# EAGLE schematic ControlBoard (EAGLE 6.3)
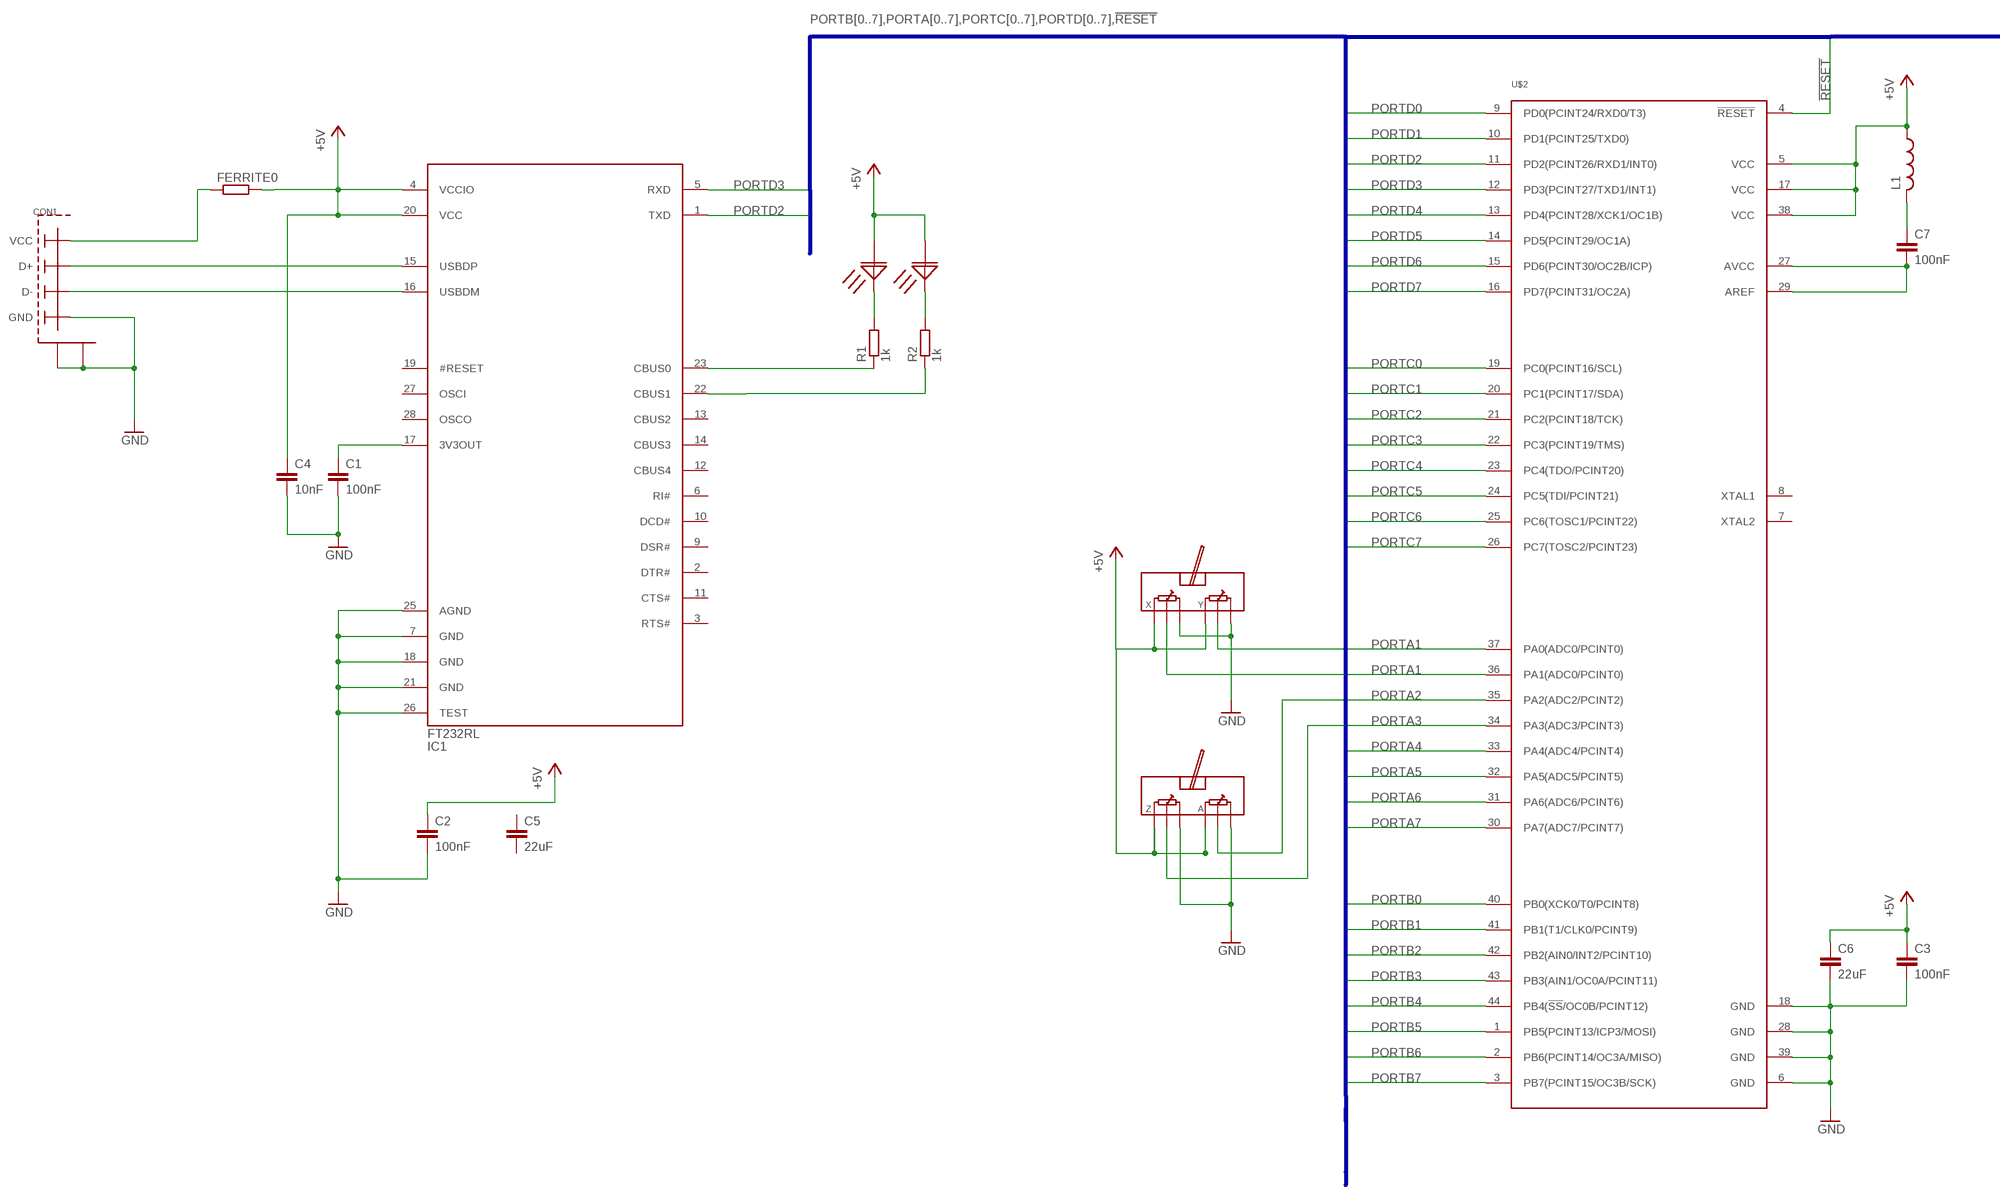
[diagram p0: schematic, sheet 1, part 1 of 2]
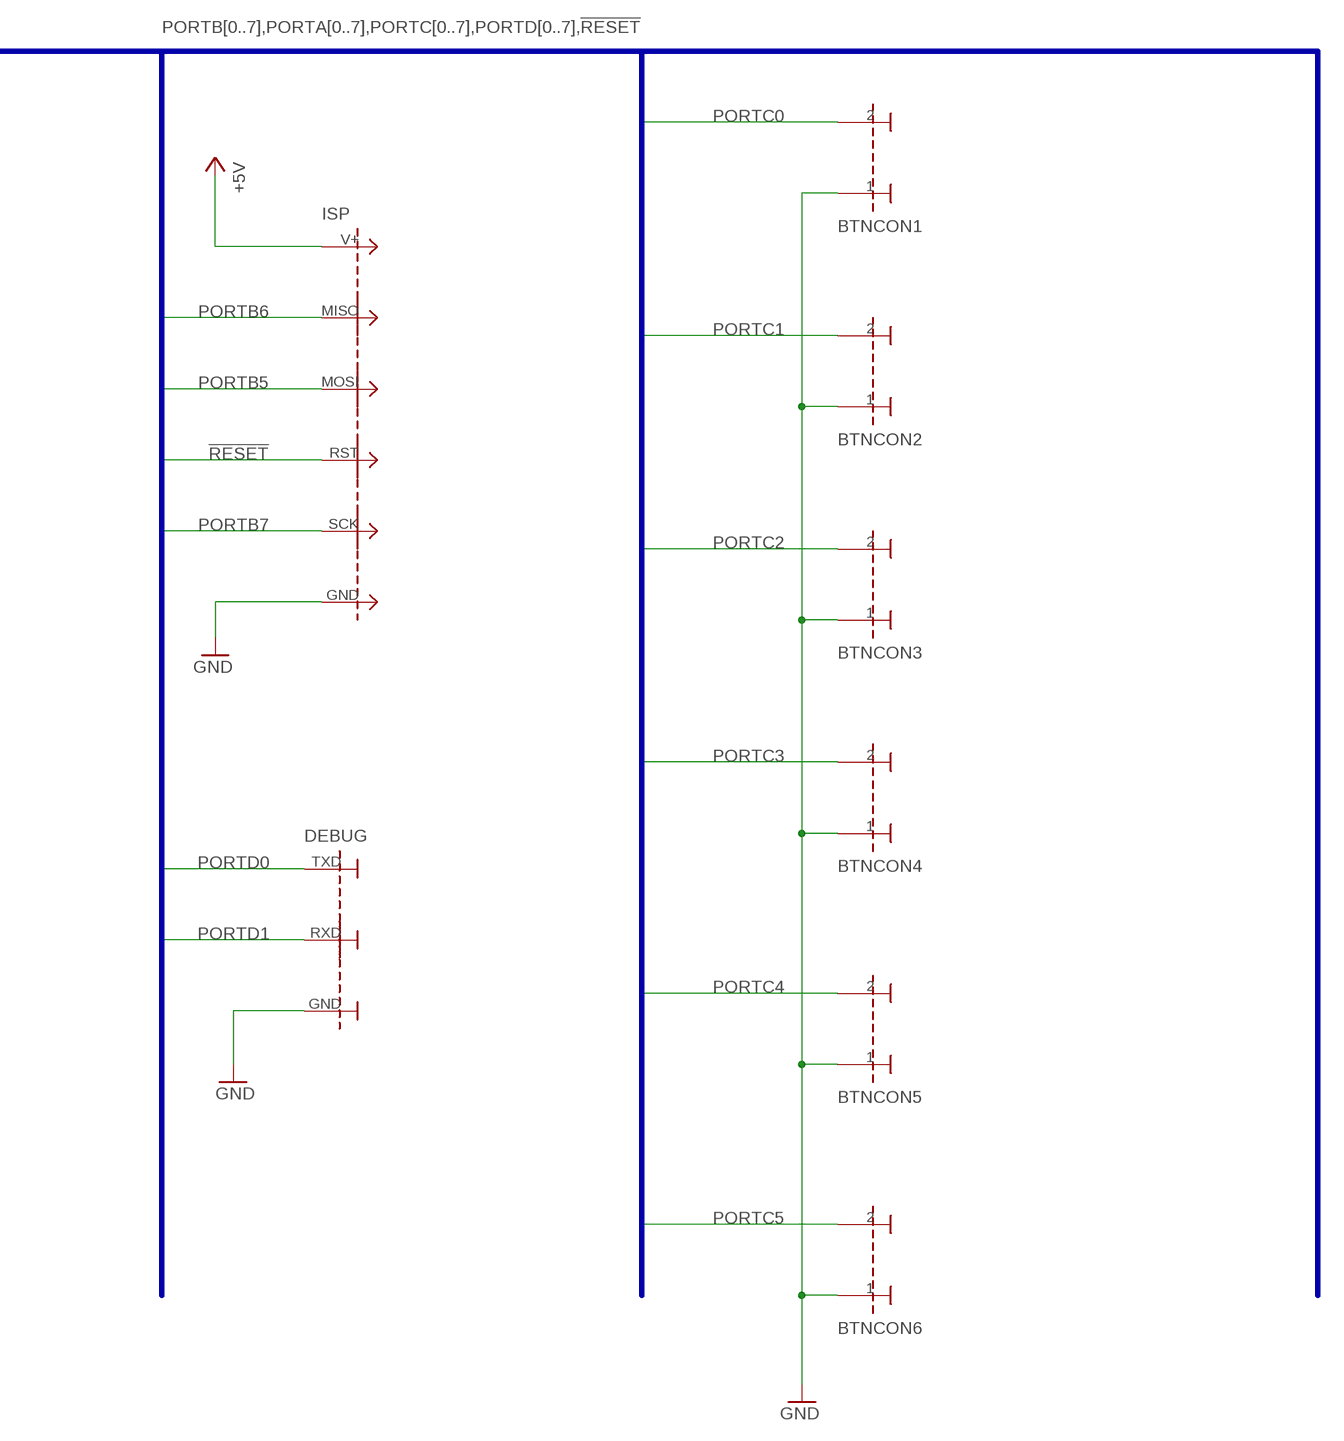
[diagram p1: schematic, sheet 1, part 2 of 2]

## Parts
BTNCON1  CONNECTOR_2PIN1X2_WIRE  [1X2_WIRE]
BTNCON2  CONNECTOR_2PIN1X2_WIRE  [1X2_WIRE]
BTNCON3  CONNECTOR_2PIN1X2_WIRE  [1X2_WIRE]
BTNCON4  CONNECTOR_2PIN1X2_WIRE  [1X2_WIRE]
BTNCON5  CONNECTOR_2PIN1X2_WIRE  [1X2_WIRE]
BTNCON6  CONNECTOR_2PIN1X2_WIRE  [1X2_WIRE]
C1  100nF  C-EUC0805  [C0805@1]
C2  100nF  C-EUC0805  [C0805@1]
C3  100nF  C-EUC0805  [C0805@1]
C4  10nF  C-EUC0805  [C0805@1]
C5  22uF  C-EUC1206  [C1206]
C6  22uF  C-EUC1206  [C1206]
C7  100nF  C-EUC0805  [C0805@1]
CON1  USB-BWUERTH-ELECTRONIC-USB-B  [USB-B-THROUGH-HOLE]
DEBUG  CONNECTOR_3PINUSART  [1X3_USART]
FERRITE0  R-EU_R0805  [R0805]
IC1  FT232RL  [SSOP28]
ISP  CONNECTOR_6PIN2X3_ISP  [2X3_ISP]
JOYSTICK1  JOYSTIC-XYRKJXK122000D  [JOYSTICK-RKJXK122000D]
JOYSTICK2  JOYSTIC-XYRKJXK122000D  [JOYSTICK-RKJXK122000D]
L1  L-USL0805  [C0805]
R1  1k  R-EU_R0805  [R0805]
R2  1k  R-EU_R0805  [R0805]
RX  LED  [LED_0805]
TX  LED  [LED_0805]
U$2  ATMEGA[164/324/644/644][A/PA]TQFP/QFN/MLF  [QFP-44]

## Nets
!RESET: ISP.RST U$2.4(!RESET)
+5V: C2.1 C3.1 C4.1 C6.1 FERRITE0.2 IC1.4(VCCIO) IC1.20(VCC) ISP.V+ JOYSTICK1.X1 JOYSTICK1.Y1 JOYSTICK2.X1 JOYSTICK2.Y1 L1.1 RX.A TX.A U$2.5(VCC) U$2.17(VCC) U$2.38(VCC)
GND: BTNCON1.1 BTNCON2.1 BTNCON3.1 BTNCON4.1 BTNCON5.1 BTNCON6.1 C1.2 C2.2 C3.2 C4.2 C6.2 CON1.GND CON1.SHIELD CON1.SHIELD@2(SHIELD) DEBUG.GND IC1.7(GND) IC1.18(GND) IC1.21(GND) IC1.25(AGND) IC1.26(TEST) ISP.GND JOYSTICK1.X3 JOYSTICK1.Y3 JOYSTICK2.X3 JOYSTICK2.Y3 U$2.6(GND) U$2.18(GND) U$2.28(GND) U$2.39(GND)
N$1: C7.2 U$2.27(AVCC) U$2.29(AREF)
N$2: IC1.23(CBUS0) R1.1
N$3: IC1.22(CBUS1) R2.1
N$4: R1.2 RX.K
N$5: C7.1 L1.2
N$6: CON1.D+ IC1.15(USBDP)
N$7: CON1.D- IC1.16(USBDM)
N$8: CON1.VCC FERRITE0.1
N$9: R2.2 TX.K
N$10: C1.1 IC1.17(3V3OUT)
PORTA0: JOYSTICK1.Y2 U$2.37(PA0(ADC0/PCINT0))
PORTA1: JOYSTICK1.X2 U$2.36(PA1(ADC0/PCINT0))
PORTA2: JOYSTICK2.Y2 U$2.35(PA2(ADC2/PCINT2))
PORTA3: JOYSTICK2.X2 U$2.34(PA3(ADC3/PCINT3))
PORTA4: U$2.33(PA4(ADC4/PCINT4))
PORTA5: U$2.32(PA5(ADC5/PCINT5))
PORTA6: U$2.31(PA6(ADC6/PCINT6))
PORTA7: U$2.30(PA7(ADC7/PCINT7))
PORTB0: U$2.40(PB0(XCK0/T0/PCINT8))
PORTB1: U$2.41(PB1(T1/CLK0/PCINT9))
PORTB2: U$2.42(PB2(AIN0/INT2/PCINT10))
PORTB3: U$2.43(PB3(AIN1/OC0A/PCINT11))
PORTB4: U$2.44(PB4(!SS!/OC0B/PCINT12))
PORTB5: ISP.MOSI U$2.1(PB5(PCINT13/ICP3/MOSI))
PORTB6: ISP.MISO U$2.2(PB6(PCINT14/OC3A/MISO))
PORTB7: ISP.SCK U$2.3(PB7(PCINT15/OC3B/SCK))
PORTC0: BTNCON1.2 U$2.19(PC0(PCINT16/SCL))
PORTC1: BTNCON2.2 U$2.20(PC1(PCINT17/SDA))
PORTC2: BTNCON3.2 U$2.21(PC2(PCINT18/TCK))
PORTC3: BTNCON4.2 U$2.22(PC3(PCINT19/TMS))
PORTC4: BTNCON5.2 U$2.23(PC4(TDO/PCINT20))
PORTC5: BTNCON6.2 U$2.24(PC5(TDI/PCINT21))
PORTC6: U$2.25(PC6(TOSC1/PCINT22))
PORTC7: U$2.26(PC7(TOSC2/PCINT23))
PORTD0: DEBUG.TXD U$2.9(PD0(PCINT24/RXD0/T3))
PORTD1: DEBUG.RXD U$2.10(PD1(PCINT25/TXD0))
PORTD2: IC1.1(TXD) U$2.11(PD2(PCINT26/RXD1/INT0))
PORTD3: IC1.5(RXD) U$2.12(PD3(PCINT27/TXD1/INT1))
PORTD4: U$2.13(PD4(PCINT28/XCK1/OC1B))
PORTD5: U$2.14(PD5(PCINT29/OC1A))
PORTD6: U$2.15(PD6(PCINT30/OC2B/ICP))
PORTD7: U$2.16(PD7(PCINT31/OC2A))
Unconnected: C5.1 C5.2 IC1.2(DTR#) IC1.3(RTS#) IC1.6(RI#) IC1.9(DSR#) IC1.10(DCD#) IC1.11(CTS#) IC1.12(CBUS4) IC1.13(CBUS2) IC1.14(CBUS3) IC1.19(#RESET) IC1.27(OSCI) IC1.28(OSCO) U$2.7(XTAL2) U$2.8(XTAL1)

## Buses
PORTB[0..7],PORTA[0..7],PORTC[0..7],PORTD[0..7],!RESET

## Library data of the parts
BTNCON1-BTNCON6 = connectors:CONNECTOR_2PIN; OC_NEWARK: unknown; PIN1: 1; PIN2: 2
C1-C3 C7 = RC_and_L:C-EU: CAPACITOR, European symbol; MF: FARNELL; MPN: KP-2012SEC; OC_NEWARK: 38K3382
C4 = RC_and_L:C-EU: CAPACITOR, European symbol; MPN: 04023D103KAT2A; OC_NEWARK: 50R8273
C5 C6 = RC_and_L:C-EU: CAPACITOR, European symbol; OC_NEWARK: unknown
CON1 = jogwheelParts:USB-B: USB, type B connector.; DATASHEET: http://www.farnell.com/datasheets/1442182.pdf; FARNELL: http://fi.farnell.com/jsp/search/productdetail.jsp?SKU=1642035; OC_NEWARK: unknown
DEBUG = connectors:CONNECTOR_3PIN; OC_NEWARK: unknown; PIN1: TXD; PIN2: RXD; PIN3: GND
FERRITE0 R1 R2 = RC_and_L:R-EU_: RESISTOR, European symbol; OC_NEWARK: unknown
IC1 = jogwheelParts:FT232RL: FTDI - FT232RL - IC, USB TO UART, SMD, SSOP28, 232; DATASHEET: http://www.farnell.com/datasheets/11529.pdf; FARNELL: http://fi.farnell.com/ftdi/ft232rl/ic-usb-to-uart-smd-ssop28-232/dp/1146032; OC_NEWARK: unknown
ISP = connectors:CONNECTOR_6PIN; OC_NEWARK: unknown
JOYSTICK1 = jogwheelParts:JOYSTIC-XY; FIRST-AXIS: X; OC_NEWARK: unknown; SECOND-AXIS: Y
JOYSTICK2 = jogwheelParts:JOYSTIC-XY; FIRST-AXIS: Z; OC_NEWARK: unknown; SECOND-AXIS: A
L1 = RC_and_L:L-US: INDUCTOR, American symbol; OC_NEWARK: unknown
RX TX = jogwheelParts:LED
U$2 = jogwheelParts:ATMEGA[164/324/644/644][A/PA]: http://www.atmel.com/Images/doc8272.pdf; OC_NEWARK: unknown